# Altium schematic sheet PMIC.SchDoc
size A3
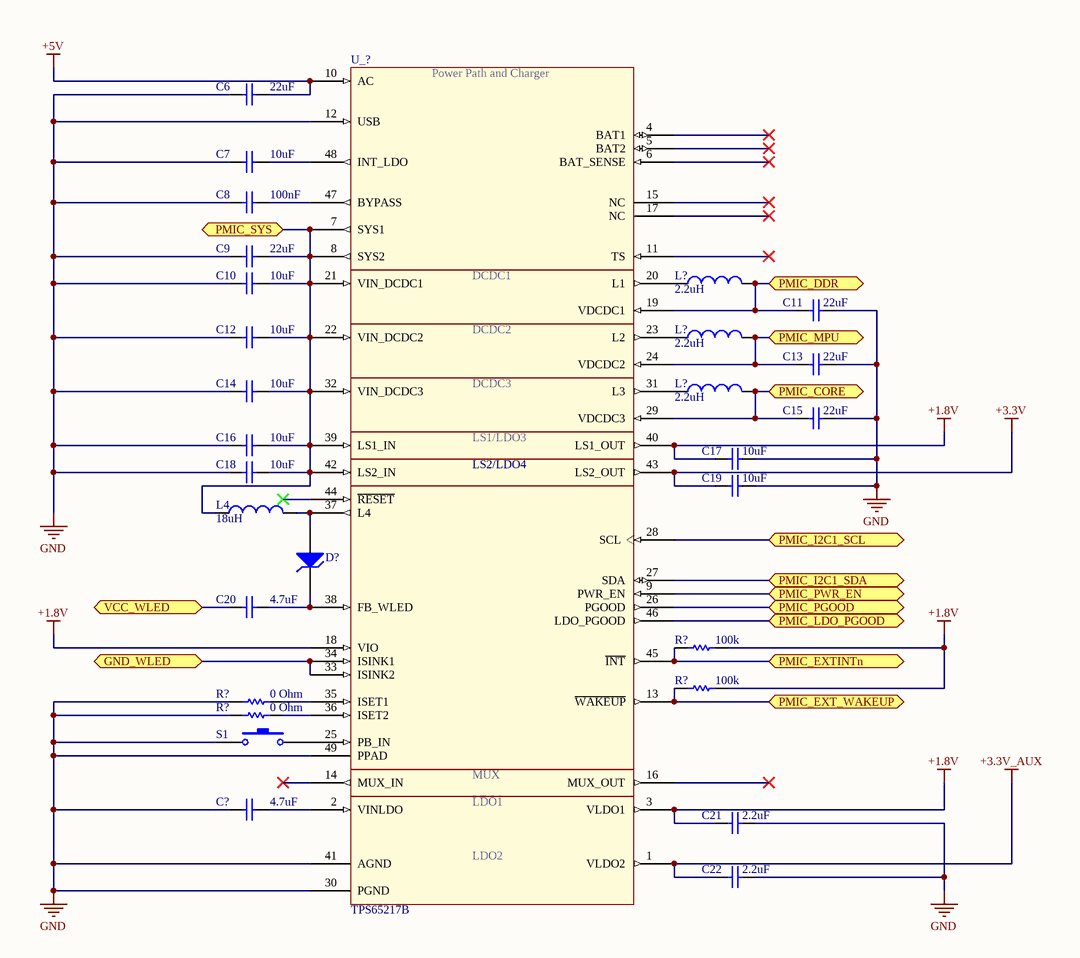
[diagram p0: PMIC.SchDoc]

## Parts
(Parts that share a designator on the sheet are numbered #1, #2 ... from top to bottom, then left to right.)
C6  value 22uF  [RAD-0.3]  (hidden comment: Cap)
C7  value 10uF  [RAD-0.3]  (hidden comment: Cap)
C8  value 100nF  [RAD-0.3]  (hidden comment: Cap)
C9  value 22uF  [RAD-0.3]  (hidden comment: Cap)
C10  value 10uF  [RAD-0.3]  (hidden comment: Cap)
C11  value 22uF  [RAD-0.3]  (hidden comment: Cap)
C12  value 10uF  [RAD-0.3]  (hidden comment: Cap)
C13  value 22uF  [RAD-0.3]  (hidden comment: Cap)
C14  value 10uF  [RAD-0.3]  (hidden comment: Cap)
C15  value 22uF  [RAD-0.3]  (hidden comment: Cap)
C16  value 10uF  [RAD-0.3]  (hidden comment: Cap)
C17  value 10uF  [RAD-0.3]  (hidden comment: Cap)
C18  value 10uF  [RAD-0.3]  (hidden comment: Cap)
C19  value 10uF  [RAD-0.3]  (hidden comment: Cap)
C20  value 4.7uF  [RAD-0.3]  (hidden comment: Cap)
C21  value 2.2uF  [RAD-0.3]  (hidden comment: Cap)
C22  value 2.2uF  [RAD-0.3]  (hidden comment: Cap)
C?  value 4.7uF  [RAD-0.3]  (hidden comment: Cap)
D?  D Zener  [DIODE-0.7]  (value not drawn)
L4  value 18uH  [0402-A]  (hidden comment: Inductor)
L?#1  value 2.2uH  [0402-A]  (hidden comment: Inductor)
L?#2  value 2.2uH  [0402-A]  (hidden comment: Inductor)
L?#3  value 2.2uH  [0402-A]  (hidden comment: Inductor)
R?#1  value 100k  [AXIAL-0.3]  (hidden comment: Res1)
R?#2  value 100k  [AXIAL-0.3]  (hidden comment: Res1)
R?#3  value 0 Ohm  [AXIAL-0.3]  (hidden comment: Res1)
R?#4  value 0 Ohm  [AXIAL-0.3]  (hidden comment: Res1)
S1  SW-PB  [SPST-2]  (value not drawn)
U_?  TPS65217B  [QFN40P600X600X900-4849]

## Ports
GND_WLED, PMIC_CORE, PMIC_DDR, PMIC_EXT_WAKEUP, PMIC_EXTINTn, PMIC_I2C1_SCL, PMIC_I2C1_SDA, PMIC_LDO_PGOOD, PMIC_MPU, PMIC_PGOOD, PMIC_PWR_EN, PMIC_SYS, VCC_WLED

## Nets
+1.8V: C17.1 C21.1 R?#1.2 R?#2.2 U_?.3(VLDO1) U_?.18(VIO) U_?.40(LS1_OUT)
+3.3V: C19.1 U_?.43(LS2_OUT)
+3.3V_AUX: C22.1 U_?.1(VLDO2)
+5V: C6.2 U_?.10(AC)
GND: C6.1 C7.1 C8.1 C9.1 C10.1 C11.1 C12.1 C13.1 C14.1 C15.1 C16.1 C17.2 C18.1 C19.2 C21.2 C22.2 C?.1 R?#3.1 R?#4.1 S1.1 U_?.12(USB) U_?.30(PGND) U_?.41(AGND) U_?.49(PPAD)
GND_WLED: U_?.33(ISINK2) U_?.34(ISINK1) ; port GND_WLED
PMIC_CORE: C15.2 L?#3.2 U_?.29(VDCDC3) ; port PMIC_CORE
PMIC_DDR: C11.2 L?#1.2 U_?.19(VDCDC1) ; port PMIC_DDR
PMIC_EXT_WAKEUP: R?#2.1 U_?.13(~{WAKEUP}) ; port PMIC_EXT_WAKEUP
PMIC_EXTINTn: R?#1.1 U_?.45(~{INT}) ; port PMIC_EXTINTn
PMIC_I2C1_SCL: U_?.28(SCL) ; port PMIC_I2C1_SCL
PMIC_I2C1_SDA: U_?.27(SDA) ; port PMIC_I2C1_SDA
PMIC_LDO_PGOOD: U_?.46(LDO_PGOOD) ; port PMIC_LDO_PGOOD
PMIC_MPU: C13.2 L?#2.2 U_?.24(VDCDC2) ; port PMIC_MPU
PMIC_PGOOD: U_?.26(PGOOD) ; port PMIC_PGOOD
PMIC_PWR_EN: U_?.9(PWR_EN) ; port PMIC_PWR_EN
PMIC_SYS: C9.2 C10.2 C12.2 C14.2 C16.2 C18.2 L4.1 U_?.7(SYS1) U_?.8(SYS2) U_?.21(VIN_DCDC1) U_?.22(VIN_DCDC2) U_?.32(VIN_DCDC3) U_?.39(LS1_IN) U_?.42(LS2_IN) ; port PMIC_SYS
VCC_WLED: C20.1 ; port VCC_WLED
NetC7_2: C7.2 U_?.48(INT_LDO)
NetC8_2: C8.2 U_?.47(BYPASS)
NetC20_2: C20.2 D?.2(K) U_?.38(FB_WLED)
NetC?_2: C?.2 U_?.2(VINLDO)
NetD?_1: D?.1(A) L4.2 U_?.37(L4)
NetL?#1_1: L?#1.1 U_?.20(L1)
NetL?#2_1: L?#2.1 U_?.23(L2)
NetL?#3_1: L?#3.1 U_?.31(L3)
NetR?#3_2: R?#3.2 U_?.35(ISET1)
NetR?#4_2: R?#4.2 U_?.36(ISET2)
NetS1_2: S1.2 U_?.25(PB_IN)

Not connected (* = marked no-connect by the designer): U_? 4(BAT1)* 5(BAT2)* 6(BAT_SENSE)* 11(TS)* 14(MUX_IN)* 15(NC)* 16(MUX_OUT)* 17(NC)* 44(~{RESET})*

## Notes on the sheet
- (in symbol TPS65217x) Power Path and Charger; DCDC1; DCDC2; DCDC3; LS1/LDO3; LS2/LDO4; MUX; LDO1; LDO2

## Library data of the parts
C6-C9 C16-C22 C? = Cap: Capacitor
C10 C12 C14 = Cap: Capacitor; Fabricant: TDK; Fournisseur: Farnell; RefFabricant: C2012X5R0J226M125AC; RefFournisseur: 2372273
C11 C13 = Cap: Capacitor; Fabricant: Murata; Fournisseur: Farnell; RefFabricant: LQM2HPN2R2MG0L; RefFournisseur: 2470284
C15 = Cap: Capacitor; RefFabricant: LQM2HPN2R2MG0L; Fabricant: Murata; Fournisseur: Farnell; RefFournisseur: 2470284
D? = D Zener: Zener Diode; RefFabricant: LM4041DIM3-1.2; RefFournisseur: 9778349; Fabricant: Texas Instruments; Fournisseur: Farnell
L4 = Inductor: Fabricant: TAIYO YUDEN; Fournisseur: Farnell; RefFabricant: UMK316BJ475KL-T; RefFournisseur: 2112859
L?#1-L?#3 = Inductor: Fabricant: Murata; Fournisseur: Farnell; RefFabricant: LQM2HPN2R2MG0L; RefFournisseur: 2470284
R?#1-R?#4 = Res1: Resistor
S1 = SW-PB: Switch; RefFabricant: FSM1LP; RefFournisseur: 1813691; Fabricant: TE CONNECTIVITY; Fournisseur: Farnell
U_? = TPS65217x: Gestion d'alimentation PMIC; Fabricant: Texas Instruments; Fournisseur: Farnell; RefFabricant: TPS65217CRSLT; RefFournisseur: 2492485